# EAGLE design elmett_shield (EAGLE 7.2.0)
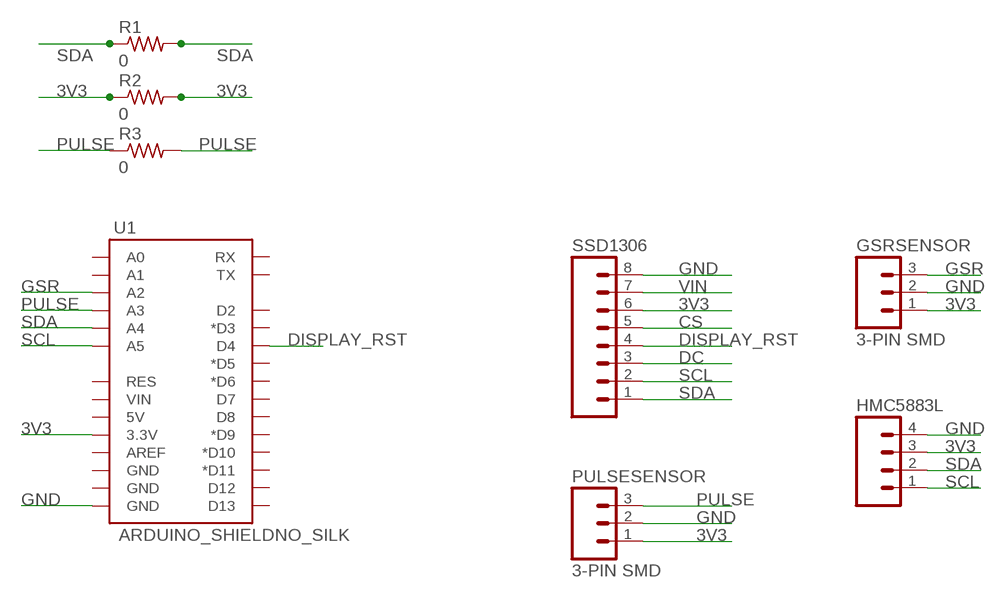
[diagram p0: schematic, sheet 1]

## Parts
GSRSENSOR  3-PIN SMD  M03JST-SMD  [JST-3-SMD]
HMC5883L  M04PTH  [1X04]
PULSESENSOR  3-PIN SMD  M03JST-SMD  [JST-3-SMD]
R1  0  RESISTOR1206  [1206]
R2  0  RESISTOR1206  [1206]
R3  0  RESISTOR1206  [1206]
SSD1306  M08  [1X08_ROUND]
U1  ARDUINO_SHIELDNO_SILK  [DUEMILANOVE_VIAS]

## Nets
3V3: GSRSENSOR.1 HMC5883L.3 PULSESENSOR.1 R2.1 R2.2 SSD1306.6 U1.3.3V
CS: SSD1306.5
DC: SSD1306.3
DISPLAY_RST: SSD1306.4 U1.D4
GND: GSRSENSOR.2 HMC5883L.4 PULSESENSOR.2 SSD1306.8 U1.GND@0(GND)
GSR: GSRSENSOR.3 U1.A2
PULSE: PULSESENSOR.3 R3.1 R3.2 U1.A3
SCL: HMC5883L.1 SSD1306.2 U1.A5
SDA: HMC5883L.2 R1.1 R1.2 SSD1306.1 U1.A4
VIN: SSD1306.7
Unconnected: U1.5V U1.A0 U1.A1 U1.AREF U1.D2 U1.D3(*D3) U1.D5(*D5) U1.D6(*D6) U1.D7 U1.D8 U1.D9(*D9) U1.D10(*D10) U1.D11(*D11) U1.D12 U1.D13 U1.GND@1(GND) U1.GND@2(GND) U1.RES U1.RX U1.TX U1.VIN

## Library data of the parts
GSRSENSOR PULSESENSOR = SparkFun-Connectors:M03: Header 3 Standard 3-pin 0.1" header. Use with straight break away headers (SKU : PRT-00116), right angle break away headers (PRT-00553), swiss pins (PRT-00743), machine pins (PRT-00117), and female headers (PRT-00115). Molex polarized connector foot print use with SKU : PRT-08232 with associated crimp pins and housings.; PROD_ID: CONN-12591
HMC5883L = SparkFun-Connectors:M04: Header 4 Standard 4-pin 0.1" header. Use with straight break away headers (SKU : PRT-00116), right angle break away headers (PRT-00553), swiss pins (PRT-00743), machine pins (PRT-00117), and female headers (PRT-00115). Molex polarized connector foot print use with SKU : PRT-08231 with associated crimp pins and housings. 1MM SMD Version SKU: PRT-10208
R1-R3 = FAB_Hello:RESISTOR
SSD1306 = SparkFun-Connectors:M08: Header 8 Standard 8-pin 0.1" header. Use with straight break away headers (SKU : PRT-00116), right angle break away headers (PRT-00553), swiss pins (PRT-00743), machine pins (PRT-00117), and female headers (PRT-00115).
U1 = SparkFun-Boards:ARDUINO_SHIELD: Arduino shield footprint

## Board
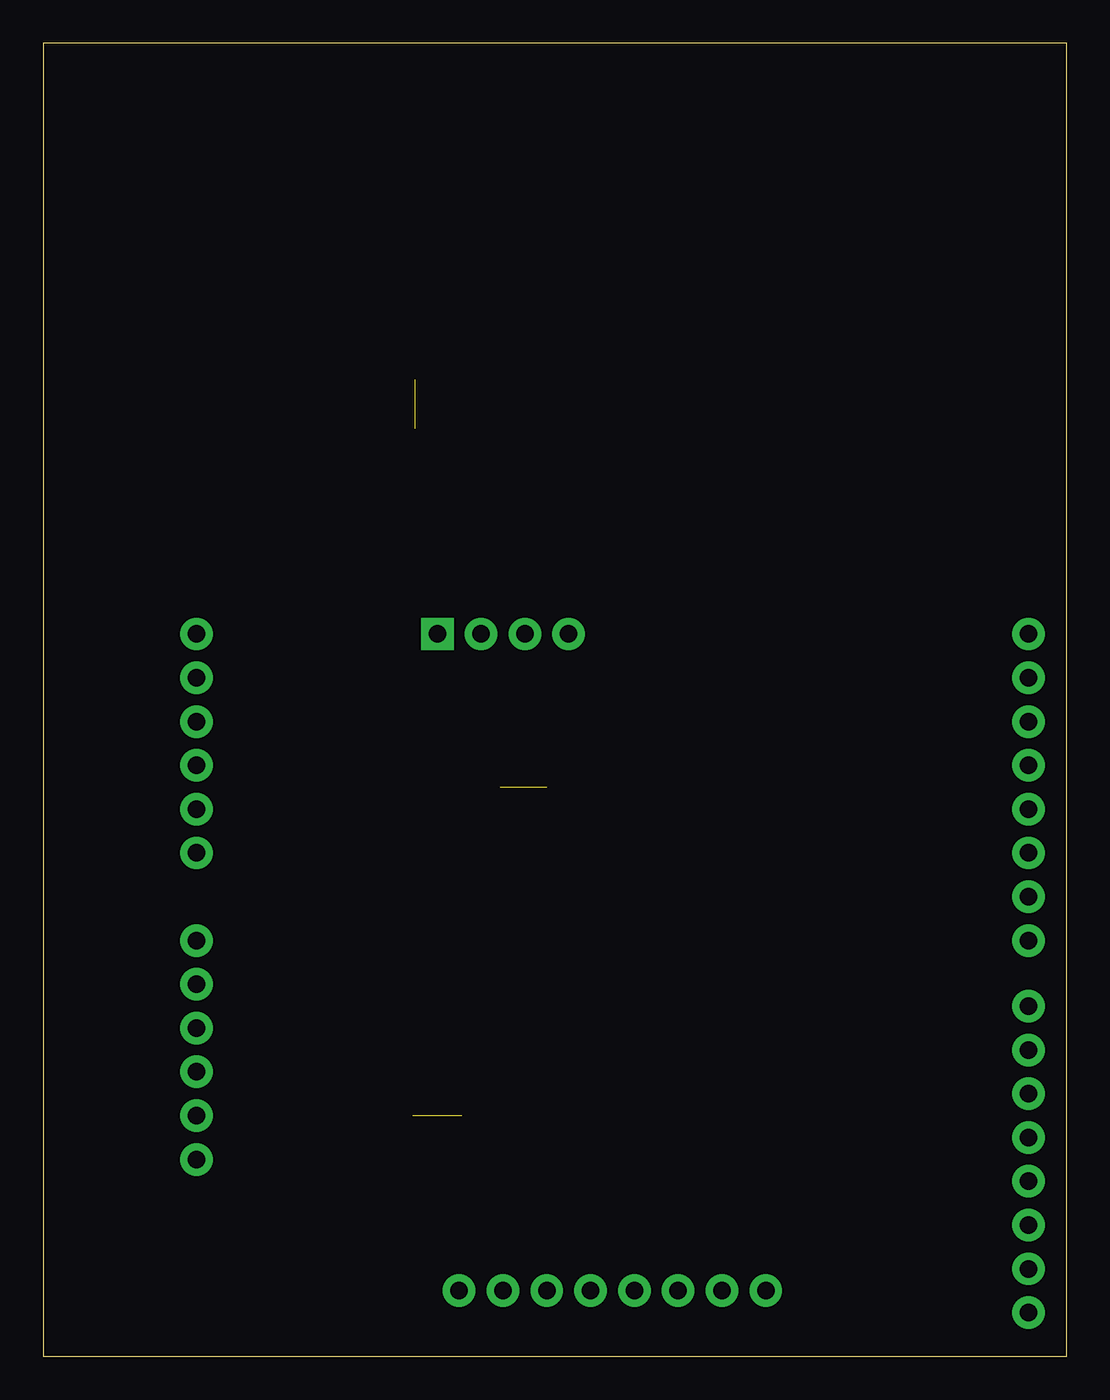
[diagram p1: board, top side]
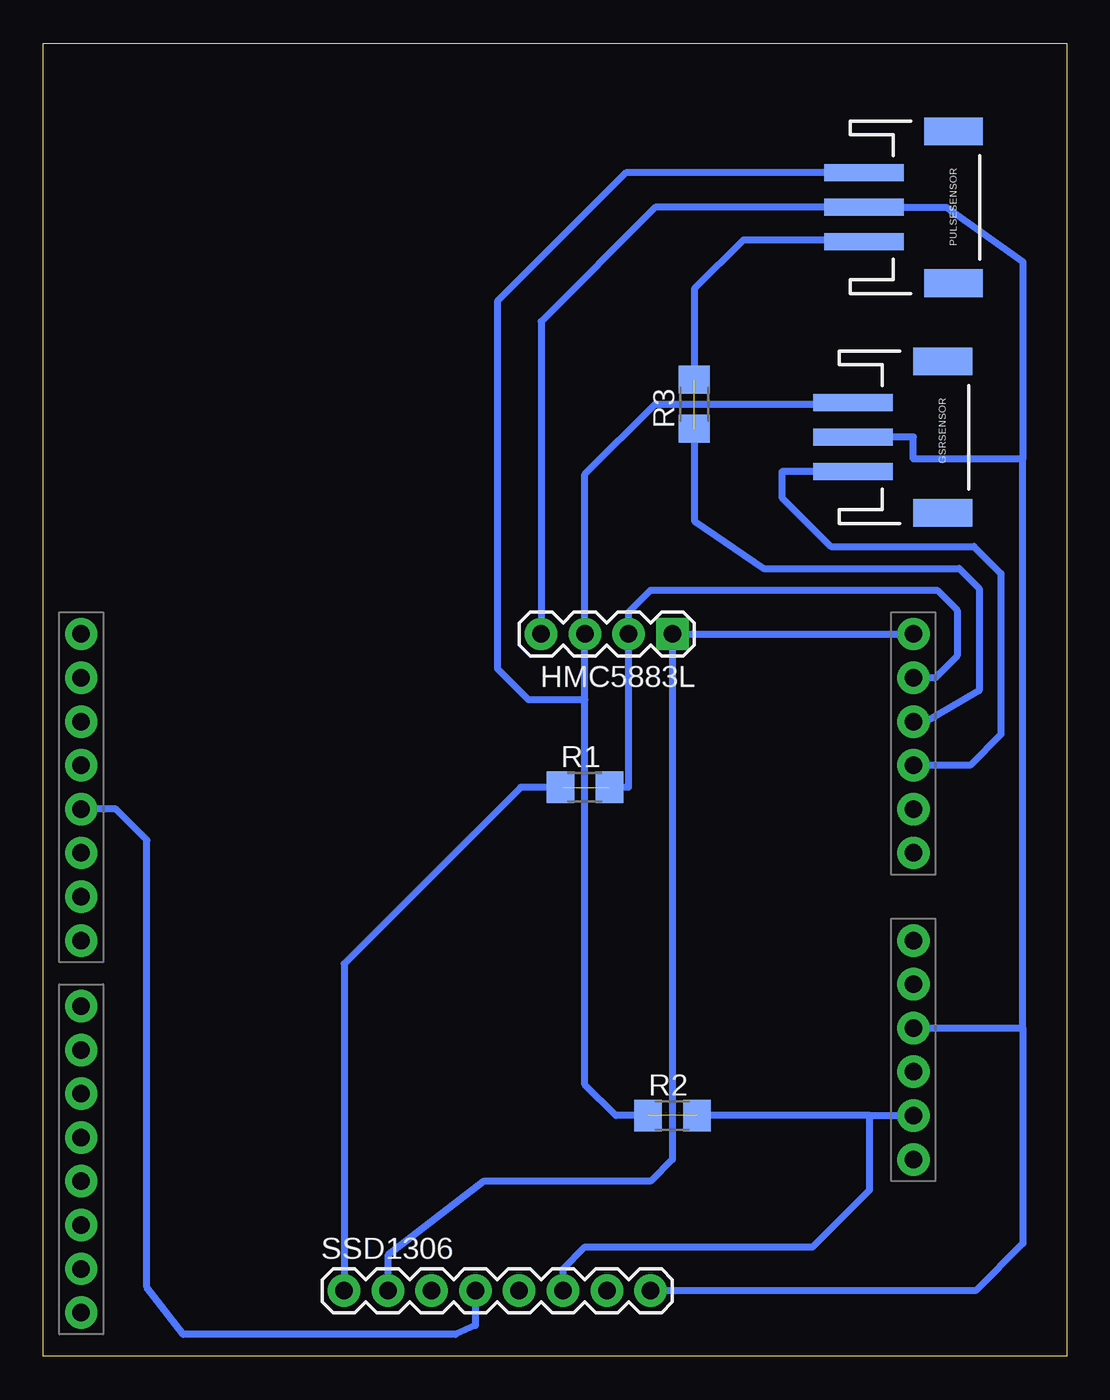
[diagram p2: board, bottom side, seen from below]

Size 59.36 x 76.19 mm. Coordinates in mm from the lower left corner, seen from the top.
Outline: 0,0 59.36,0 59.36,76.19 0,76.19 0,0
Copper layers (1*16): Top 0.035mm / dielectric 1.5mm / Bottom 0.035mm
Design rules "default": minimum track width 10mil, minimum drill 24mil, track to track 8mil, track to pad 8mil, pad to pad 8mil, via to via 8mil, smd to smd 8mil, copper to edge 40mil, drill to drill 8mil, minimum pad ring 10mil, minimum via ring 8mil, stop-mask expansion 4mil, vias tented up to drill 0mil, thermal gap 10mil

### Footprints (pad centres in the part's own frame; a part is rotated, then mirrored left to right if it is on the bottom)
JST-3-SMD = smd 1 x 4.6: 1 -1.99,-4.77; 2 0.01,-4.77; 3 2.01,-4.77 | smd 1.6 x 3.4: NC1 -4.39,0.43; NC2 4.41,0.43
1X04 = drill 1.016 pad 1.88 square: 1 0,0 | drill 1.016 pad 1.88: 2 2.54,0; 3 5.08,0; 4 7.62,0
1206 = smd 1.6 x 1.803: 1 -1.422,0; 2 1.422,0
1X08_ROUND = drill 1.016 pad 1.88: 1 0,0; 2 2.54,0; 3 5.08,0; 4 7.62,0; 5 10.16,0; 6 12.7,0; 7 15.24,0; 8 17.78,0
DUEMILANOVE_VIAS = drill 1.016 pad 1.88: 3.3V 50.8,13.97; 5V 50.8,16.51; A0 50.8,29.21; A1 50.8,31.75; A2 50.8,34.29; A3 50.8,36.83; A4 50.8,39.37; A5 50.8,41.91; AREF 2.54,2.54; D2 2.54,36.83; D3 2.54,34.29; D4 2.54,31.75; D5 2.54,29.21; D6 2.54,26.67; D7 2.54,24.13; D8 2.54,20.32; D9 2.54,17.78; D10 2.54,15.24; D11 2.54,12.7; D12 2.54,10.16; D13 2.54,7.62; GND@0 50.8,19.05; GND@1 50.8,21.59; GND@2 2.54,5.08; RES 50.8,11.43; RX 2.54,41.91; TX 2.54,39.37; VIN 50.8,24.13

### Placement (x,y rotation side)
GSRSENSOR  7.62,53.34 270 bottom
HMC5883L  22.86,41.91 180 bottom
PULSESENSOR  6.99,66.67 270 bottom
R1  27.94,33.02 0 bottom
R2  22.86,13.97 0 bottom
R3  21.59,55.24 90 bottom
SSD1306  41.91,3.81 0 bottom
U1  59.69,0 0 bottom

### Tracks (layer width: path | path; a pad name or v marks a point on that pad's centre or on a via)
3V3  (1 unrouted)
  Bottom 0.406: 11.43,68.67 PULSESENSOR.1 25.57,68.67 33.02,61.22 33.02,39.9 31.22,38.1 27.94,38.1 HMC5883L.3 | HMC5883L.3 27.94,51.18 23.87,55.24 12.39,55.24 GSRSENSOR.1 | SSD1306.6 29.21,5.08 27.94,6.35 14.74,6.35 11.43,9.66 11.43,13.97 | 11.43,13.97 U1.3.3V | R2.1 26.14,13.97 27.94,15.77 HMC5883L.3 | 11.43,13.97 R2.2
DISPLAY_RST
  Bottom 0.406: SSD1306.4 34.29,1.8 35.45,1.27 51.23,1.27 53.34,4.02 53.34,29.95 55.14,31.75 U1.D4
GND
  Bottom 0.406: HMC5883L.4 30.48,60.04 23.85,66.67 PULSESENSOR.2 6.98,66.67 2.54,63.5 2.54,52.07 | 2.54,52.07 8.89,52.07 8.89,53.34 GSRSENSOR.2 | 2.54,19.05 2.54,52.07 | U1.GND@0 2.54,19.05 | 2.54,19.05 2.54,6.56 5.29,3.81 SSD1306.8
GSR
  Bottom 0.406: GSRSENSOR.3 16.51,51.33 16.51,49.83 13.67,46.99 5.38,46.99 3.81,45.42 3.81,36.09 5.61,34.29 U1.A2
PULSE  (1 unrouted)
  Bottom 0.406: U1.A3 8.15,36.83 5.08,38.63 5.08,44.56 6.24,45.72 17.57,45.72 21.59,48.47 R3.1 | R3.2 21.59,61.93 18.75,64.77 11.76,64.77 PULSESENSOR.3
SCL
  Bottom 0.406: U1.A5 HMC5883L.1 22.86,11.43 24.13,10.16 33.8,10.16 39.37,5.86 SSD1306.2
SDA  (1 unrouted)
  Bottom 0.406: SSD1306.1 41.91,22.78 31.67,33.02 R1.1 29.21,33.02 | R1.2 25.4,33.02 HMC5883L.2 25.4,43.18 24.13,44.45 7.51,44.45 6.35,43.29 6.35,40.64 7.62,39.37 U1.A4